# Altium project Capacitive Soil Moisture Sensor.PrjPcb
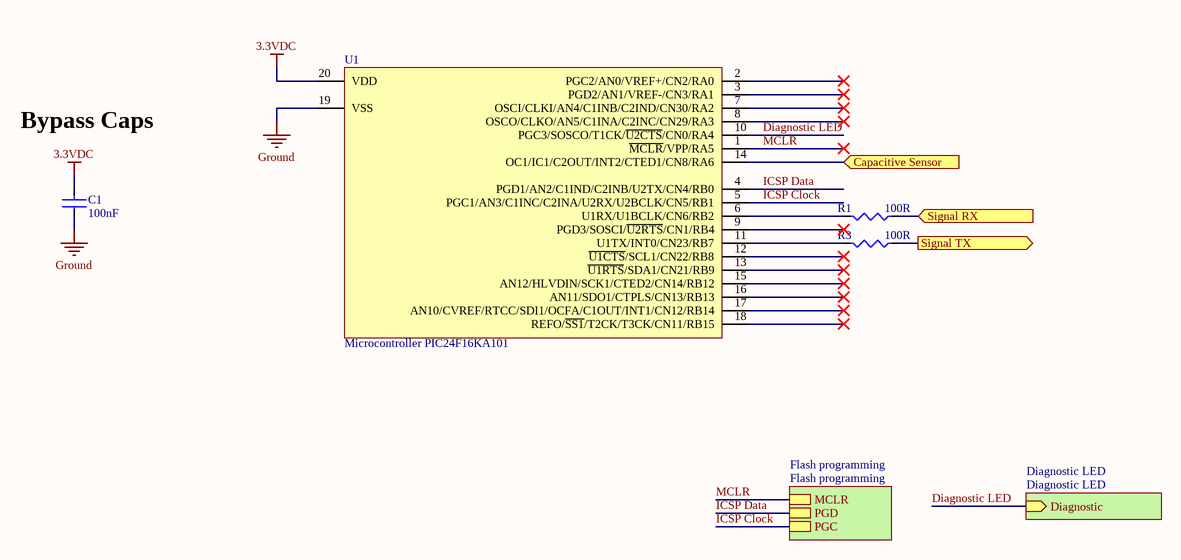
[diagram p0: PIC24F16KA101.SchDoc]
ProjectTitle: Capacitive Soil Moisture Sensor; ProjectRevision: v0.1.0; Designer: Craig Comberbach
2 sheets, 8 parts. Net scope: hierarchical (ports join the sheet entries above them; power ports are global).
Board file: Capacitive Soil Moisture Sensor.PCBDOC
Sheets:
  PIC24F16KA101.SchDoc
  Coplanar Capacitive Sensor.SchDoc

## Sheet PIC24F16KA101.SchDoc: Mircoprocessor
size Letter; Date: 2014-12-09; DocumentNumber: 8; Revision: A; SheetNumber: 8; SheetTotal: 10; DesignedBy: Craig Comberbach

### Parts
C1  Capacitance: 100nF  [C0805 - Ceramic]  (hidden comment: 100nF 0805 100V)
R1  Resistance (Ohms): 100R  [R0805]  (hidden comment: 100R 0805 1%)
R3  Resistance (Ohms): 100R  [R0805]  (hidden comment: 100R 0805 1%)
U1  Microcontroller PIC24F16KA101  [SOIC-20]

### Sub-sheets
Diagnostic LED = Diagnostic LED (file not in this document): Diagnostic (in)
Flash programming = Flash programming (file not in this document): MCLR, PGD, PGC

### Ports
Capacitive Sensor (in), Signal RX (in), Signal TX (out)

### Nets
3.3VDC: C1.1 U1.20(VDD)
Ground: C1.2 U1.19(VSS)
Diagnostic LED: U1.10(PGC3/SOSCO/T1CK/~{U2CTS}/CN0/RA4) ; sheet Diagnostic LED/Diagnostic
ICSP Clock: U1.5(PGC1/AN3/C1INC/C2INA/U2RX/U2BCLK/CN5/RB1) ; sheet Flash programming/PGC
ICSP Data: U1.4(PGD1/AN2/C1IND/C2INB/U2TX/CN4/RB0) ; sheet Flash programming/PGD
MCLR: U1.1(~{MCLR}/VPP/RA5) ; sheet Flash programming/MCLR
NetR1_1: R1.1 U1.6(U1RX/U1BCLK/CN6/RB2)
NetR1_2: R1.2 ; port Signal RX
NetR3_1: R3.1 U1.11(U1TX/INT0/CN23/RB7)
NetR3_2: R3.2 ; port Signal TX
NetU1_14: U1.14(OC1/IC1/C2OUT/INT2/CTED1/CN8/RA6) ; port Capacitive Sensor

Not connected (* = marked no-connect by the designer): U1 2(PGC2/AN0/VREF+/CN2/RA0)* 3(PGD2/AN1/VREF-/CN3/RA1)* 7(OSCI/CLKI/AN4/C1INB/C2IND/CN30/RA2)* 8(OSCO/CLKO/AN5/C1INA/C2INC/CN29/RA3)* 9(PGD3/SOSCI/~{U2RTS}/CN1/RB4)* 12(~{U1CTS}/SCL1/CN22/RB8)* 13(~{U1RTS}/SDA1/CN21/RB9)* 15(AN12/HLVDIN/SCK1/CTED2/CN14/RB12)* 16(AN11/SDO1/CTPLS/CN13/RB13)* 17(AN10/CVREF/RTCC/SDI1/OCFA/C1OUT/INT1/CN12/RB14)* 18(REFO/~{SS1}/T2CK/T3CK/CN11/RB15)*

### Notes on the sheet
- Bypass Caps
- Cct
- Designed by
- Rev
- Date
- Sheet
- of

### Library data of the parts
C1 = 100nF 0805 100V: Manufacturer: Samsung Electro-Mechanics America, Inc; Manufacturer Part Number: CL21B104KCFSFNE; Tolerance: ±10%; Temperature Coefficient: X7R; Supplier 1: Digi-Key; RoHS: RoHS Compliant; Category: Capacitors; Stock 1: 396483; Pricing 1: 1=0.12, 10=0.059, 25=0.0424, 50=0.0324, 100=0.0274, 250=0.02236, 500=0.01912, 1000=0.0149 (CAD); Packaging: Cut Tape (CT); Voltage - Rated: 100V; Mounting Type: Surface Mount, MLCC; Operating Temperature: -55°C ~ 125°C; Applications: General Purpose; Ratings: -; Package / Case: 0805 (2012 Metric); Size / Dimension: 0.079" L x 0.049" W (2.00mm x 1.25mm); Height - Seated (Max): -; Thickness (Max): 0.053" (1.35mm); Lead Spacing: -; Features: -; Lead Style: -; ComponentLink1URL: http://www.samsungsem.com/servlet/FileDownload?type=spec&file=CL21B104KCFSFNE.pdf; ComponentLink1Description: Spec Sheet; Supplier Part Number 1: 1276-2923-1-ND; Value: 100nF 0805 100V
R1 R3 = 100R 0805 1%: 1/8W; Manufacturer: Stackpole Electronics Inc; Manufacturer Part Number: RMCF0805FT100R; Power (Watts): 0.125W, 1/8W; Temperature Coefficient: ±100ppm/°C; Technology: SMT; Value: 100R 0805 1%; Supplier 1: Digi-Key; RoHS: RoHS Compliant; Category: Resistors; Stock 1: 98560; Pricing 1: 1=0.1, 10=0.029, 50=0.0162, 100=0.0123, 250=0.00912, 500=0.00672, 1000=0.00448, 2500=0.00378 (USD); Packaging: Cut Tape (CT); Tolerance: ±1%; Composition: Thick Film; Features: -; Package / Case: 0805 (2012 Metric); Supplier Device Package: 0805; Size / Dimension: 0.079" L x 0.049" W (2.00mm x 1.25mm); Height: 0.026" (0.65mm); Number of Terminations: 2; ComponentLink1URL: http://www.seielect.com/Catalog/SEI-RMCF_RMCP.pdf; ComponentLink1Description: Spec Sheet; Supplier Part Number 1: RMCF0805FT100RCT-ND
U1 = Microcontroller PIC24F16KA101: 16-Bit Flash Microcontroller with nanoWatt XLP Technology, 16KB Flash, 1.5KB SRAM, 20-Pin SOIC, Industrial Temperature; Manufacturer: Microchip Technology; Manufacturer Part Number: PIC24F16KA101-I/SO; Core Processor: PIC; Speed: 32MHz; Connectivity: I²C, IrDA, SPI, UART/USART; Peripherals: Brown-out Detect/Reset, POR, PWM, WDT; Number of I/O: 18; Program Memory Size: 16KB (5.5K x 24); EEPROM Size: 512 x 8; RAM Size: 1.5K x 8; Voltage - Supply (Vcc/Vdd): 1.8 V ~ 3.6 V; Data Converters: A/D 9x10b; Oscillator Type: Internal; Supplier 1: Digi-Key; RoHS: RoHS Compliant; Category: Integrated Circuits (ICs); Stock 1: 223; Pricing 1: 1=2.72, 10=2.27, 25=2.06, 100=1.88 (USD); Packaging: Tube; Core Size: 16-Bit; Program Memory Type: FLASH; Operating Temperature: -40°C ~ 85°C; Package / Case: 20-SOIC (0.295", 7.50mm Width); Supplier Device Package: 20-SOIC; ComponentLink1URL: http://www.microchip.com/mymicrochip/filehandler.aspx?ddocname=en540739; ComponentLink1Description: Spec Sheet; Supplier Part Number 1: PIC24F16KA101-I/SO-ND; Value: Microcontroller PIC24F16KA101

## Sheet Coplanar Capacitive Sensor.SchDoc: PCB Coplanar Capacitive Sensor
size Letter; Date: 2014-12-09; Revision: A; DesignedBy: Craig Comberbach
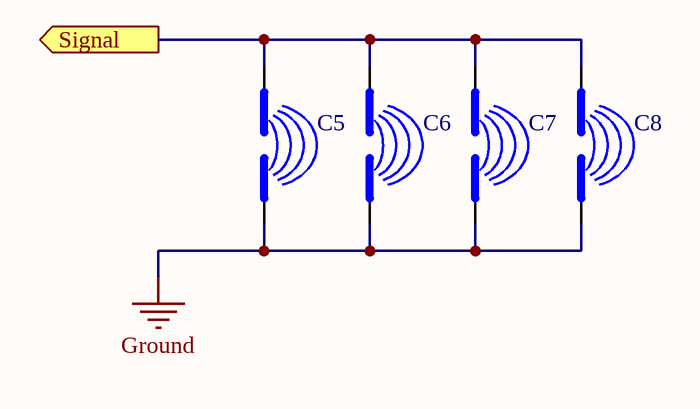
[diagram p1: Coplanar Capacitive Sensor.SchDoc]

### Parts
C5  Coplanar Capacitor  [Coplanar Capacitor]  (value not drawn)  (no BOM)
C6  Coplanar Capacitor  [Coplanar Capacitor]  (value not drawn)  (no BOM)
C7  Coplanar Capacitor  [Coplanar Capacitor]  (value not drawn)  (no BOM)
C8  Coplanar Capacitor  [Coplanar Capacitor]  (value not drawn)  (no BOM)

### Ports
Signal (out)

### Nets
Ground: C5.1 C6.1 C7.1 C8.1
NetC5_2: C5.2 C6.2 C7.2 C8.2 ; port Signal

### Notes on the sheet
- Cct
- Designed by
- Rev
- Date
- Sheet
- of

## Nets that join several sheets
Ground: PIC24F16KA101 (C1.2 U1.19), Coplanar Capacitive Sensor (C5.1 C6.1 C7.1 C8.1)

## Assembly variants
4A: not fitted F2 Fuse1
6A: not fitted F2 Fuse1
12A: not fitted F2 Fuse1